# Altium schematic sheet STM32F401R.SchDoc
size A4
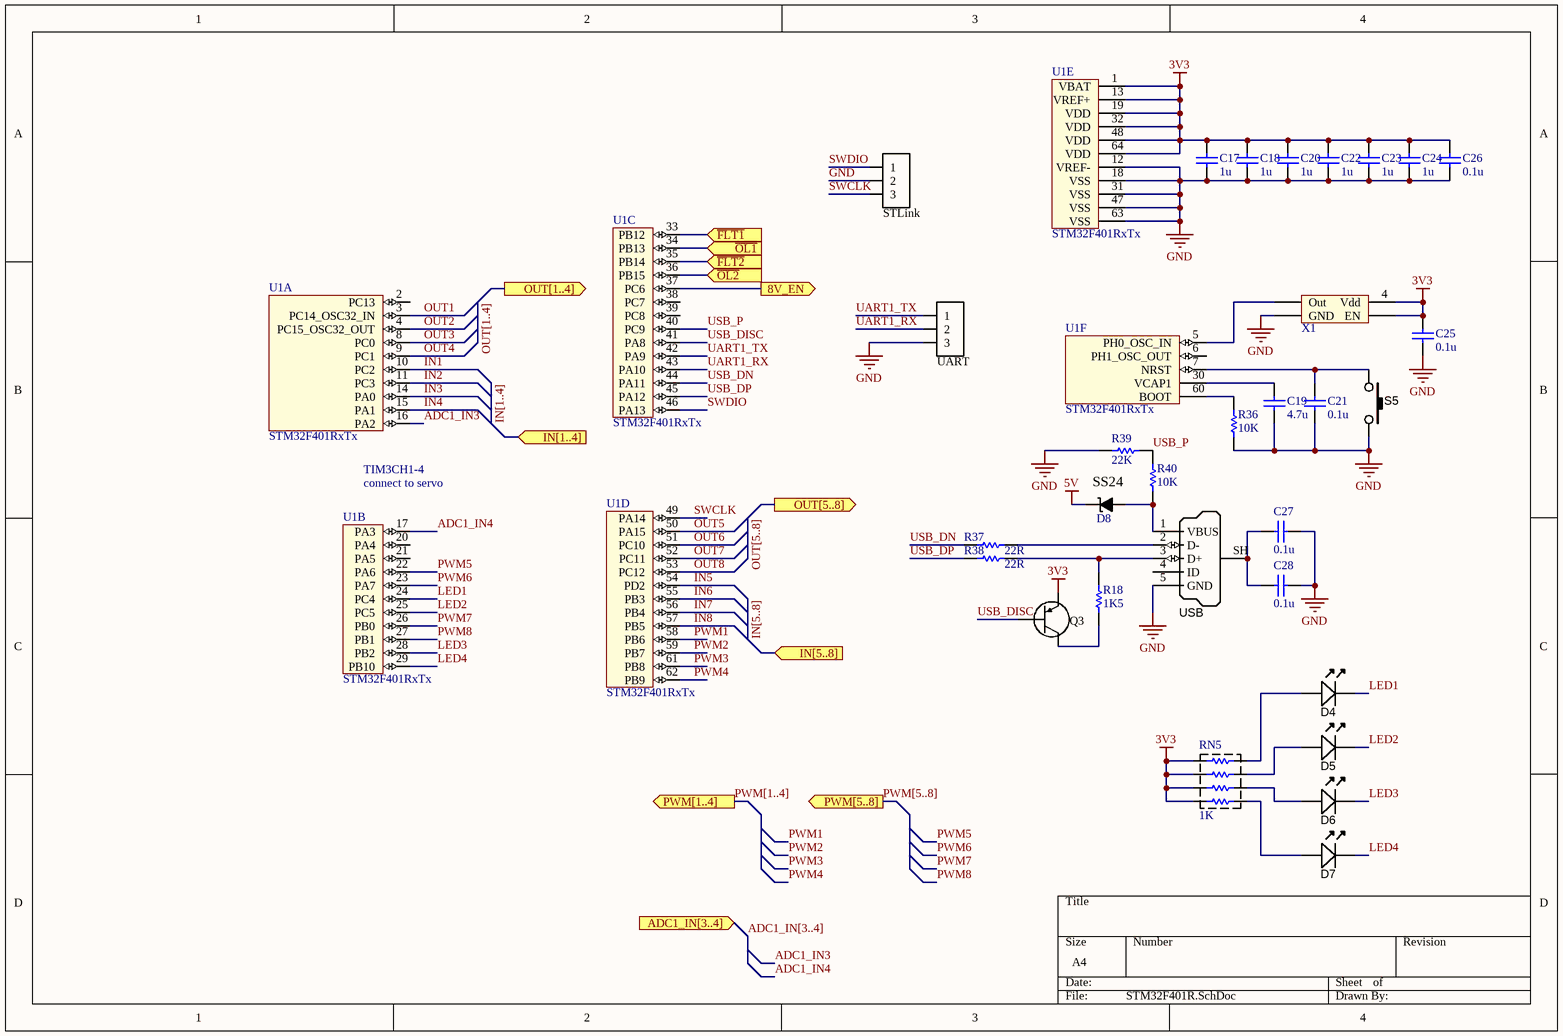
[diagram p0: STM32F401R.SchDoc]

## Parts
C17  value 1u  [CAPC1608X90N]  (hidden comment: Cap)
C18  value 1u  [CAPC1608X90N]  (hidden comment: Cap)
C19  value 4.7u  [CAPC1608X90N]  (hidden comment: Cap)
C20  value 1u  [CAPC1608X90N]  (hidden comment: Cap)
C21  value 0.1u  [CAPC1608X90N]  (hidden comment: Cap)
C22  value 1u  [CAPC1608X90N]  (hidden comment: Cap)
C23  value 1u  [CAPC1608X90N]  (hidden comment: Cap)
C24  value 1u  [CAPC1608X90N]  (hidden comment: Cap)
C25  value 0.1u  [CAPC1608X90N]  (hidden comment: Cap)
C26  value 0.1u  [CAPC1608X90N]  (hidden comment: Cap)
C27  value 0.1u  [CAPC1608X90N]  (hidden comment: Cap)
C28  value 0.1u  [CAPC1608X90N]  (hidden comment: Cap)
D4  LED_Green_GullWing  [LED-0805-A]  (value not drawn)
D5  LED_Green_GullWing  [LED-0805-A]  (value not drawn)
D6  LED_Green_GullWing  [LED-0805-A]  (value not drawn)
D7  LED_Green_GullWing  [LED-0805-A]  (value not drawn)
D8  MBRA210LT3G  [SMA]  (value not drawn)
Q3  DTA114YYUA  [SOT323]  (value not drawn)
R18  value 1K5  [RESC1608X55N]  (hidden comment: Res1)
R36  value 10K  [RESC1608X55N]  (hidden comment: Res1)
R37  value 22R  [RESC1608X55N]  (hidden comment: Res1)
R38  value 22R  [RESC1608X55N]  (hidden comment: Res1)
R39  value 22K  [RESC1608X55N]  (hidden comment: Res1)
R40  value 10K  [RESC1608X55N]  (hidden comment: Res1)
RN5  value 1K  [RESCAXS50P160X320X70-8N]  (hidden comment: resistor network)
S5  SW_THT_PB_4.3mm  [TACT_SWT-SMD-4.4]  (value not drawn)
STLink  Header  [1x3POS_HEADER]  (value not drawn)
U1  STM32F401RxTx  [LQFP64]  (parts A,B,C,D,E,F of 6)
UART  Header  [1x3POS_HEADER]  (value not drawn)
USB  USB Micro Type B  [USB_MICRO-B]  (value not drawn)
X1  ASV-8.000MHZ-EJ-T  [ASV SERIES]  (value not drawn)

## Ports
8V_EN (out), ADC1_IN[3..4] (in), IN[1..4] (in), IN[5..8] (in), OUT[1..4] (out), OUT[5..8] (out), PWM[1..4] (out), PWM[5..8] (out), ~{FLT1} (in), ~{FLT2} (in), ~{OL1} (in), ~{OL2} (in)

## Nets
3V3: C17.2 C18.2 C20.2 C22.2 C23.2 C24.2 C25.2 C26.2 Q3.2(E) RN5.1 RN5.2 RN5.3 RN5.4 U1.1(VBAT) U1.13(VREF+) U1.19(VDD) U1.32(VDD) U1.48(VDD) U1.64(VDD) X1.1(EN) X1.4(Vdd)
5V: D8.K(Cathode)
GND: C17.1 C18.1 C19.1 C20.1 C21.1 C22.1 C23.1 C24.1 C25.1 C26.1 C27.2 C28.2 R36.1 R39.2 S5.2 STLink.2 U1.12(VREF-) U1.18(VSS) U1.31(VSS) U1.47(VSS) U1.63(VSS) UART.3 USB.5(GND) X1.2(GND)
8V_EN: U1.37(PC6) ; port 8V_EN
ADC1_IN3: U1.16(PA2)
ADC1_IN4: U1.17(PA3)
~{FLT1}: U1.33(PB12) ; port ~{FLT1}
~{FLT2}: U1.35(PB14) ; port ~{FLT2}
IN1: U1.10(PC2)
IN2: U1.11(PC3)
IN3: U1.14(PA0)
IN4: U1.15(PA1)
IN5: U1.54(PD2)
IN6: U1.55(PB3)
IN7: U1.56(PB4)
IN8: U1.57(PB5)
LED1: D4.K U1.24(PC4)
LED2: D5.K U1.25(PC5)
LED3: D6.K U1.28(PB2)
LED4: D7.K U1.29(PB10)
~{OL1}: U1.34(PB13) ; port ~{OL1}
~{OL2}: U1.36(PB15) ; port ~{OL2}
OUT1: U1.3(PC14_OSC32_IN)
OUT2: U1.4(PC15_OSC32_OUT)
OUT3: U1.8(PC0)
OUT4: U1.9(PC1)
OUT5: U1.50(PA15)
OUT6: U1.51(PC10)
OUT7: U1.52(PC11)
OUT8: U1.53(PC12)
PWM1: U1.58(PB6)
PWM2: U1.59(PB7)
PWM3: U1.61(PB8)
PWM4: U1.62(PB9)
PWM5: U1.22(PA6)
PWM6: U1.23(PA7)
PWM7: U1.26(PB0)
PWM8: U1.27(PB1)
SWCLK: STLink.3 U1.49(PA14)
SWDIO: STLink.1 U1.46(PA13)
UART1_RX: U1.43(PA10) UART.2
UART1_TX: U1.42(PA9) UART.1
USB_DISC: Q3.1(B) U1.41(PA8)
USB_DN: R37.1 U1.44(PA11)
USB_DP: R38.1 U1.45(PA12)
USB_P: R39.1 R40.2 U1.40(PC9)
NetC19_2: C19.2 U1.30(VCAP1)
NetC21_2: C21.2 S5.1 U1.7(NRST)
NetC27_1: C27.1 C28.1 USB.SH(Shell)
NetD4_A: D4.A RN5.8
NetD5_A: D5.A RN5.7
NetD6_A: D6.A RN5.6
NetD7_A: D7.A RN5.5
NetD8_A: D8.A(Anode) R40.1 USB.1(VBUS)
NetQ3_3: Q3.3(C) R18.1
NetR18_2: R18.2 R38.2 USB.3(D+)
NetR36_2: R36.2 U1.60(BOOT)
NetR37_2: R37.2 USB.2(D-)
NetU1_5: U1.5(PH0_OSC_IN) X1.3(Out)

Not connected (* = marked no-connect by the designer): U1 2(PC13) 6(PH1_OSC_OUT) 20(PA4) 21(PA5) 38(PC7) 39(PC8); USB 4(ID)

## Buses and harness runs
bus ADC1_IN[3..4] = port ADC1_IN[3..4]
bus IN[1..4] = port IN[1..4]
bus IN[5..8] = port IN[5..8]
bus OUT[1..4] = port OUT[1..4]
bus OUT[5..8] = port OUT[5..8]
bus PWM[1..4] = port PWM[1..4]
bus PWM[5..8] = port PWM[5..8]

## Notes on the sheet
- (near U1) TIM3CH1-4
- (near U1) connect to servo
- SS24

## Library data of the parts
C17-C28 = Cap: Capacitor; Published: 8-Jun-2000; LatestRevisionDate: 17-Jul-2002; LatestRevisionNote: Re-released for DXP Platform.; PackageReference: RAD-0.3; Publisher: Altium Limited; PackageDescription: Radial Cap, Thru-Hole; 2 Leads; 0.3 in Pin Spacing
D4-D7 = LED_Green_GullWing: LED Gull-wing SMD High-intensity Green 450mcd 574nm; Manufacturer 1: Ligitek; Manufacturer Part Number 1: L8UG9033/TR1; Ratings: 450 mcd; 574 nm; Material: AlGaInP; SCDType: source; Package / Case: 4.6mm Gull-Wing; Color: Green
D8 = MBRA210LT3G: Surface Mount  Schottky Power Rectifier; Manufacturer: ON semiconductor; Vf: 350mV; If: 2A; Vrrm: 10V; datasheet: http://www.mouser.com/ds/2/308/MBRA210LT3-D-76406.pdf
Q3 = DTA114YYUA: PNP -100mA -50V Digital Transistor (Bias Resistor Built-in Transistor); Manufacturer: ROHM
R18 R36-R40 = Res1: Resistor; Published: 8-Jun-2000; LatestRevisionDate: 17-Jul-2002; LatestRevisionNote: Re-released for DXP Platform.; PackageReference: AXIAL-0.3; Publisher: Altium Limited; PackageDescription: Axial Device, Thru-Hole; 2 Leads; 0.3 in Pin Spacing
RN5 = RES_NET
S5 = SW_THT_PB_4.3mm: Switch, tact, 4.3mm stem; Manufacturer 1: Bond-Tact; Manufacturer Part Number 1: TS-1143-WP-300; SCDType: spec; Function: Speed; Package / Case: 6.5x6.5mm; 4.3mm stem; Material: Brass/Nylon/Ag plating
STLink UART = Header3P: Header 3-pin
USB = USB_Micro_TypeB: Connector SMD USB Micro Type B middle mount; Manufacturer 1: Molex Inc; Manufacturer Part Number 1: 47491-0001; SCDType: undef; Package / Case: SMD; Supplier 1: Digi-Key; Supplier Part Number 1: WM17142CT-ND
X1 = ASV-8.000MHZ-EJ-T: 3.3Vdc HCMOS SMD Crystal Clock Oscillator; Manufacturer: Abracon; VDD: 3.3V; Frequency: 8.000MHz